# Altium schematic sheet MCU.SchDoc: MCU
size A4; Engineer: Nuria Parra; Organization: Altium Limited; Address1: L3, 12a Rodborough Rd; Address2: Frenchs Forest; Address3: NSW; Address4: Australia 2086; Revision: 1
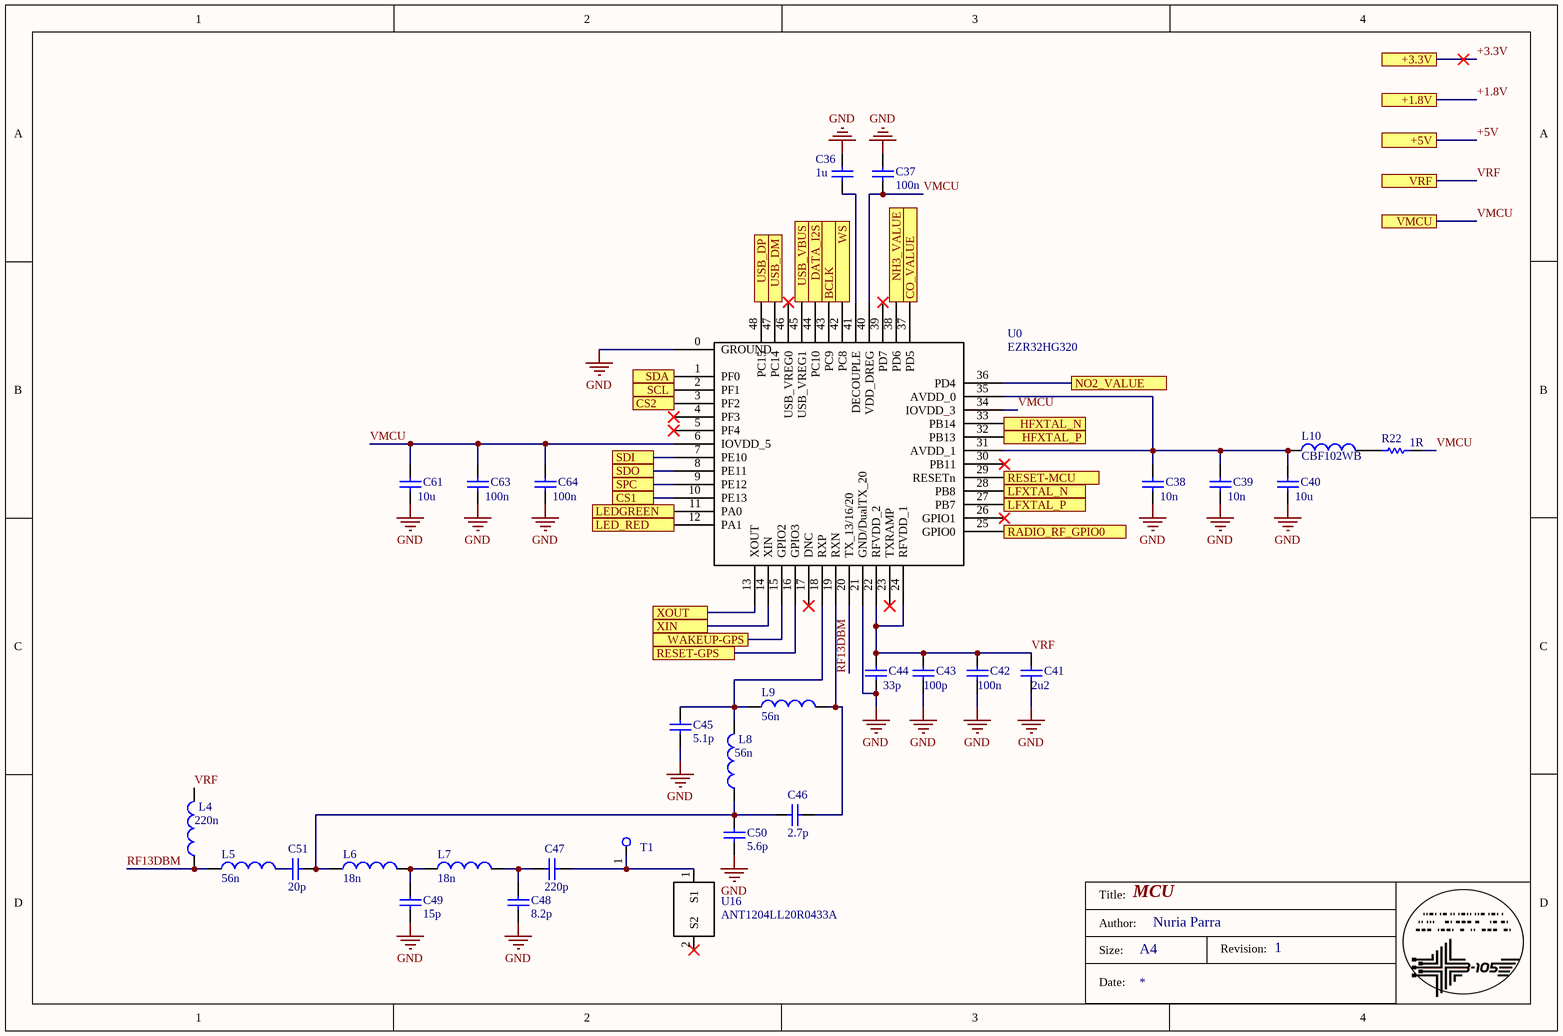
[diagram p0: MCU.SchDoc]

## Parts
C36  value 1u  [0603 Cap]  (hidden comment: Cap)
C37  value 100n  [0603 Cap]  (hidden comment: Cap)
C38  value 10n  [0603 Cap]  (hidden comment: Cap)
C39  value 10n  [0603 Cap]  (hidden comment: Cap)
C40  value 10u  [0603 Cap]  (hidden comment: Cap)
C41  value 2u2  [0603 Cap]  (hidden comment: Cap)
C42  value 100n  [0603 Cap]  (hidden comment: Cap)
C43  value 100p  [0603 Cap]  (hidden comment: Cap)
C44  value 33p  [0603 Cap]  (hidden comment: Cap)
C45  value 5.1p  [0603 Cap]  (hidden comment: Cap)
C46  value 2.7p  [0603 Cap]  (hidden comment: Cap)
C47  value 220p  [0603 Cap]  (hidden comment: Cap)
C48  value 8.2p  [0603 Cap]  (hidden comment: Cap)
C49  value 15p  [0603 Cap]  (hidden comment: Cap)
C50  value 5.6p  [0603 Cap]  (hidden comment: Cap)
C51  value 20p  [0603 Cap]  (hidden comment: Cap)
C61  value 10u  [0603 Cap]  (hidden comment: Cap)
C63  value 100n  [0603 Cap]  (hidden comment: Cap)
C64  value 100n  [0603 Cap]  (hidden comment: Cap)
L4  value 220n  [0603 IND]  (hidden comment: L?)
L5  value 56n  [0603 IND]  (hidden comment: L?)
L6  value 18n  [0603 IND]  (hidden comment: L?)
L7  value 18n  [0603 IND]  (hidden comment: L?)
L8  value 56n  [0603 IND]  (hidden comment: L?)
L9  value 56n  [0603 IND]  (hidden comment: L?)
L10  value CBF102WB  [0603 IND]  (hidden comment: L?)
R22  value 1R  [0603 Res]  (hidden comment: Res)
T1  testpoint  [testpoint]  (value not drawn)
U0  EZR32HG320  [EZ32HG]
U16  ANT1204LL20R0433A  [ANT1204LL20R0433A]

## Ports
+1.8V, +3.3V, +5V, BCLK, CO_VALUE, CS1, CS2, DATA_I2S, HFXTAL_N, HFXTAL_P, LED_RED, LEDGREEN, LFXTAL_N, LFXTAL_P, NH3_VALUE, NO2_VALUE, RADIO_RF_GPIO0, RESET-GPS, RESET-MCU, SCL, SDA, SDI, SDO, SPC, USB_DM, USB_DP, USB_VBUS, VMCU, VRF, WAKEUP-GPS, WS, XIN, XOUT

## Nets
GND: C36.1 C37.1 C38.1 C39.1 C40.1 C41.1 C42.1 C43.1 C44.1 C45.2 C48.2 C49.2 C50.2 C61.1 C63.1 C64.1 U0.0(GROUND) U0.21(GND/DualTX_20)
+1.8V: port +1.8V
+3.3V: port +3.3V
+5V: port +5V
BCLK: U0.43(PC9) ; port BCLK
CO_VALUE: U0.37(PD5) ; port CO_VALUE
CS1: U0.10(PE13) ; port CS1
CS2: U0.3(PF2) ; port CS2
DATA_I2S: U0.44(PC10) ; port DATA_I2S
HFXTAL_N: U0.33(PB14) ; port HFXTAL_N
HFXTAL_P: U0.32(PB13) ; port HFXTAL_P
LED_RED: U0.12(PA1) ; port LED_RED
LEDGREEN: U0.11(PA0) ; port LEDGREEN
LFXTAL_N: U0.28(PB8) ; port LFXTAL_N
LFXTAL_P: U0.27(PB7) ; port LFXTAL_P
NH3_VALUE: U0.38(PD6) ; port NH3_VALUE
NO2_VALUE: U0.36(PD4) ; port NO2_VALUE
RADIO_RF_GPIO0: U0.25(GPIO0) ; port RADIO_RF_GPIO0
RESET-GPS: U0.16(GPIO3) ; port RESET-GPS
RESET-MCU: U0.29(RESETn) ; port RESET-MCU
RF13DBM: L4.1 L5.1 U0.20(TX_13/16/20)
SCL: U0.2(PF1) ; port SCL
SDA: U0.1(PF0) ; port SDA
SDI: U0.7(PE10) ; port SDI
SDO: U0.8(PE11) ; port SDO
SPC: U0.9(PE12) ; port SPC
USB_DM: U0.47(PC14) ; port USB_DM
USB_DP: U0.48(PC15) ; port USB_DP
USB_VBUS: U0.45(USB_VREG1) ; port USB_VBUS
VMCU: C37.2 C61.2 C63.2 C64.2 R22.2 U0.6(IOVDD_5) U0.34(IOVDD_3) U0.40(VDD_DREG) ; port VMCU
VRF: C41.2 C42.2 C43.2 C44.2 L4.2 U0.22(RFVDD_2) U0.24(RFVDD_1) ; port VRF
WAKEUP-GPS: U0.15(GPIO2) ; port WAKEUP-GPS
WS: U0.42(PC8) ; port WS
XIN: U0.14(XIN) ; port XIN
XOUT: U0.13(XOUT) ; port XOUT
NetC36_2: C36.2 U0.41(DECOUPLE)
NetC38_2: C38.2 C39.2 C40.2 L10.1 U0.31(AVDD_1) U0.35(AVDD_0)
NetC45_1: C45.1 L8.2 L9.1 U0.18(RXP)
NetC46_1: C46.1 L9.2 U0.19(RXN)
NetC46_2: C46.2 C50.1 C51.1 L6.1 L8.1
NetC47_1: C47.1 T1.1(TP) U16.1(S1)
NetC47_2: C47.2 C48.1 L7.2
NetC49_1: C49.1 L6.2 L7.1
NetC51_2: C51.2 L5.2
NetL10_2: L10.2 R22.1

Not connected (* = marked no-connect by the designer): U0 4(PF3)* 5(PF4)* 17(DNC)* 23(TXRAMP)* 26(GPIO1)* 30(PB11)* 39(PD7)* 46(USB_VREG0)*; U16 2(S2)*

## Notes on the sheet
- Title:
- Size:
- Author:
- Date:
- A4
- Revision:

## Library data of the parts
L4-L10 = Ind